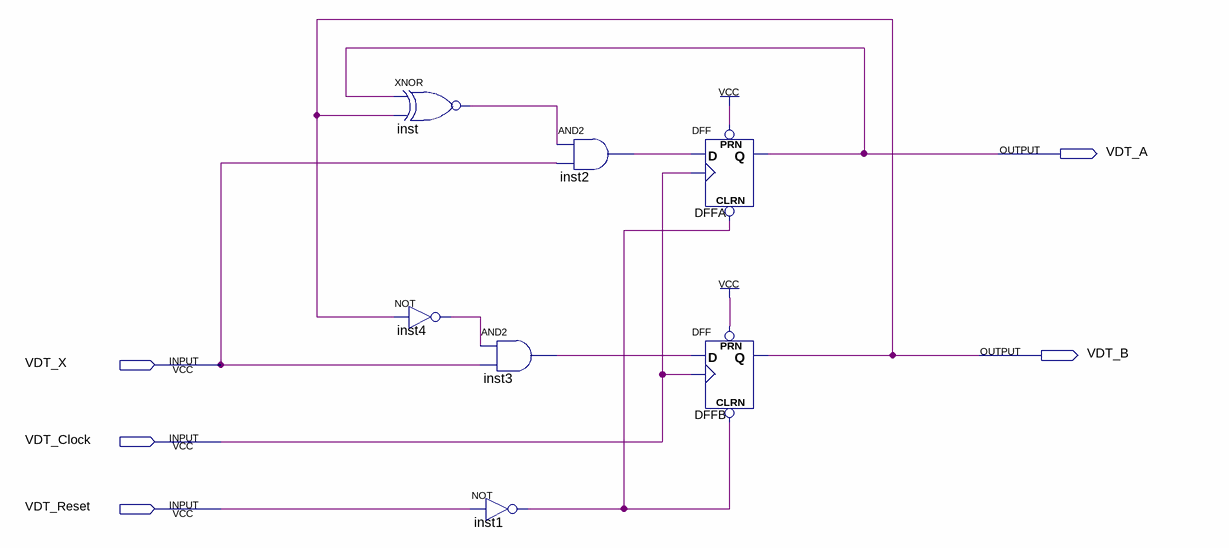
[diagram p0: schematic sheet]
// Quartus schematic assignment51.bdf as structural Verilog: 7 symbols, 5 pins
module assignment51 (
  input  VDT_X,
  input  VDT_Clock,
  input  VDT_Reset,
  output VDT_A,
  output VDT_B
);

  wire inst1_out, inst2_out, inst3_out, inst4_out, inst_out;

  xnor inst (inst_out, VDT_A, VDT_B);
  not inst4 (inst4_out, VDT_B);
  and inst3 (inst3_out, inst4_out, VDT_X);
  not inst1 (inst1_out, VDT_Reset);
  and inst2 (inst2_out, inst_out, VDT_X);
  DFF DFFA (.CLRN(inst1_out), .CLK(VDT_Clock), .D(inst2_out), .PRN(1'b1), .Q(VDT_A));
  DFF DFFB (.CLRN(inst1_out), .CLK(VDT_Clock), .D(inst3_out), .PRN(1'b1), .Q(VDT_B));
endmodule
